# Altium schematic sheet wifi.SchDoc
size A4
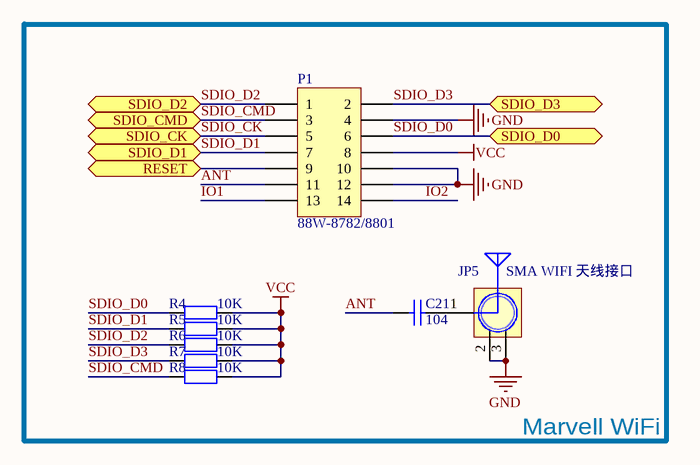
[diagram p0: wifi.SchDoc]

## Parts
C21  104  [C 0603_L]
JP5  SMA WIFI 天线接口  [SMA_FR]
P1  88W-8782/8801  [W8782_MODULE]
R4  10K  [R 0603_L]
R5  10K  [R 0603_L]
R6  10K  [R 0603_L]
R7  10K  [R 0603_L]
R8  10K  [R 0603_L]

## Blocks framed on the sheet
Marvell WiFi: C21 JP5 P1 R4-R8

## Ports
RESET (bidir), SDIO_CK (bidir), SDIO_CMD (bidir), SDIO_D0 (bidir), SDIO_D1 (bidir), SDIO_D2 (bidir), SDIO_D3 (bidir)

## Nets
GND: JP5.2(GND) JP5.3(GND) P1.4 P1.10 P1.12
VCC: P1.8 R4.1 R5.2 R6.2 R7.2 R8.2
ANT: C21.2 P1.11
IO1: P1.13
IO2: P1.14
RESET: P1.9 ; port RESET
SDIO_CK: P1.5 ; port SDIO_CK
SDIO_CMD: P1.3 R8.1 ; port SDIO_CMD
SDIO_D0: P1.6 R4.2 ; port SDIO_D0
SDIO_D1: P1.7 R5.1 ; port SDIO_D1
SDIO_D2: P1.1 R6.1 ; port SDIO_D2
SDIO_D3: P1.2 R7.1 ; port SDIO_D3
NetC21_1: C21.1 JP5.1(ANT)

## Library data of the parts
C21 = Cap: Capacitor; Published: 8-Jun-2000; LatestRevisionDate: 17-Jul-2002; LatestRevisionNote: Re-released for DXP Platform.; PackageReference: RAD-0.3; Publisher: Altium Limited; PackageDescription: Radial Cap, Thru-Hole; 2 Leads; 0.3 in Pin Spacing; Value: 104
JP5 = SMA: SMA-2.4G射频天线接口; 版权归属: 源创客; BOM名称: SMA-2.4G射频天线接口; 学习资源: www.ooocke.com
P1 = Header 7X2: Header, 7-Pin, Dual row; LatestRevisionDate: 17-Jul-2002; LatestRevisionNote: Re-released for DXP Platform.; Publisher: Altium Limited
R4-R8 = Res2: Resistor; Published: 8-Jun-2000; LatestRevisionDate: 17-Jul-2002; LatestRevisionNote: Re-released for DXP Platform.; PackageReference: AXIAL-0.4; Publisher: Altium Limited; PackageDescription: Axial Device, Thru-Hole; 2 Leads; 0.4 in Pin Spacing; Value: 10K